# Altium schematic sheet Sheet2.SchDoc
size A2; Organization: Protel International P/L; Address1: L3, 12a Rodborough Rd; Address2: Frenchs Forest; Address3: NSW; Address4: Australia 2086
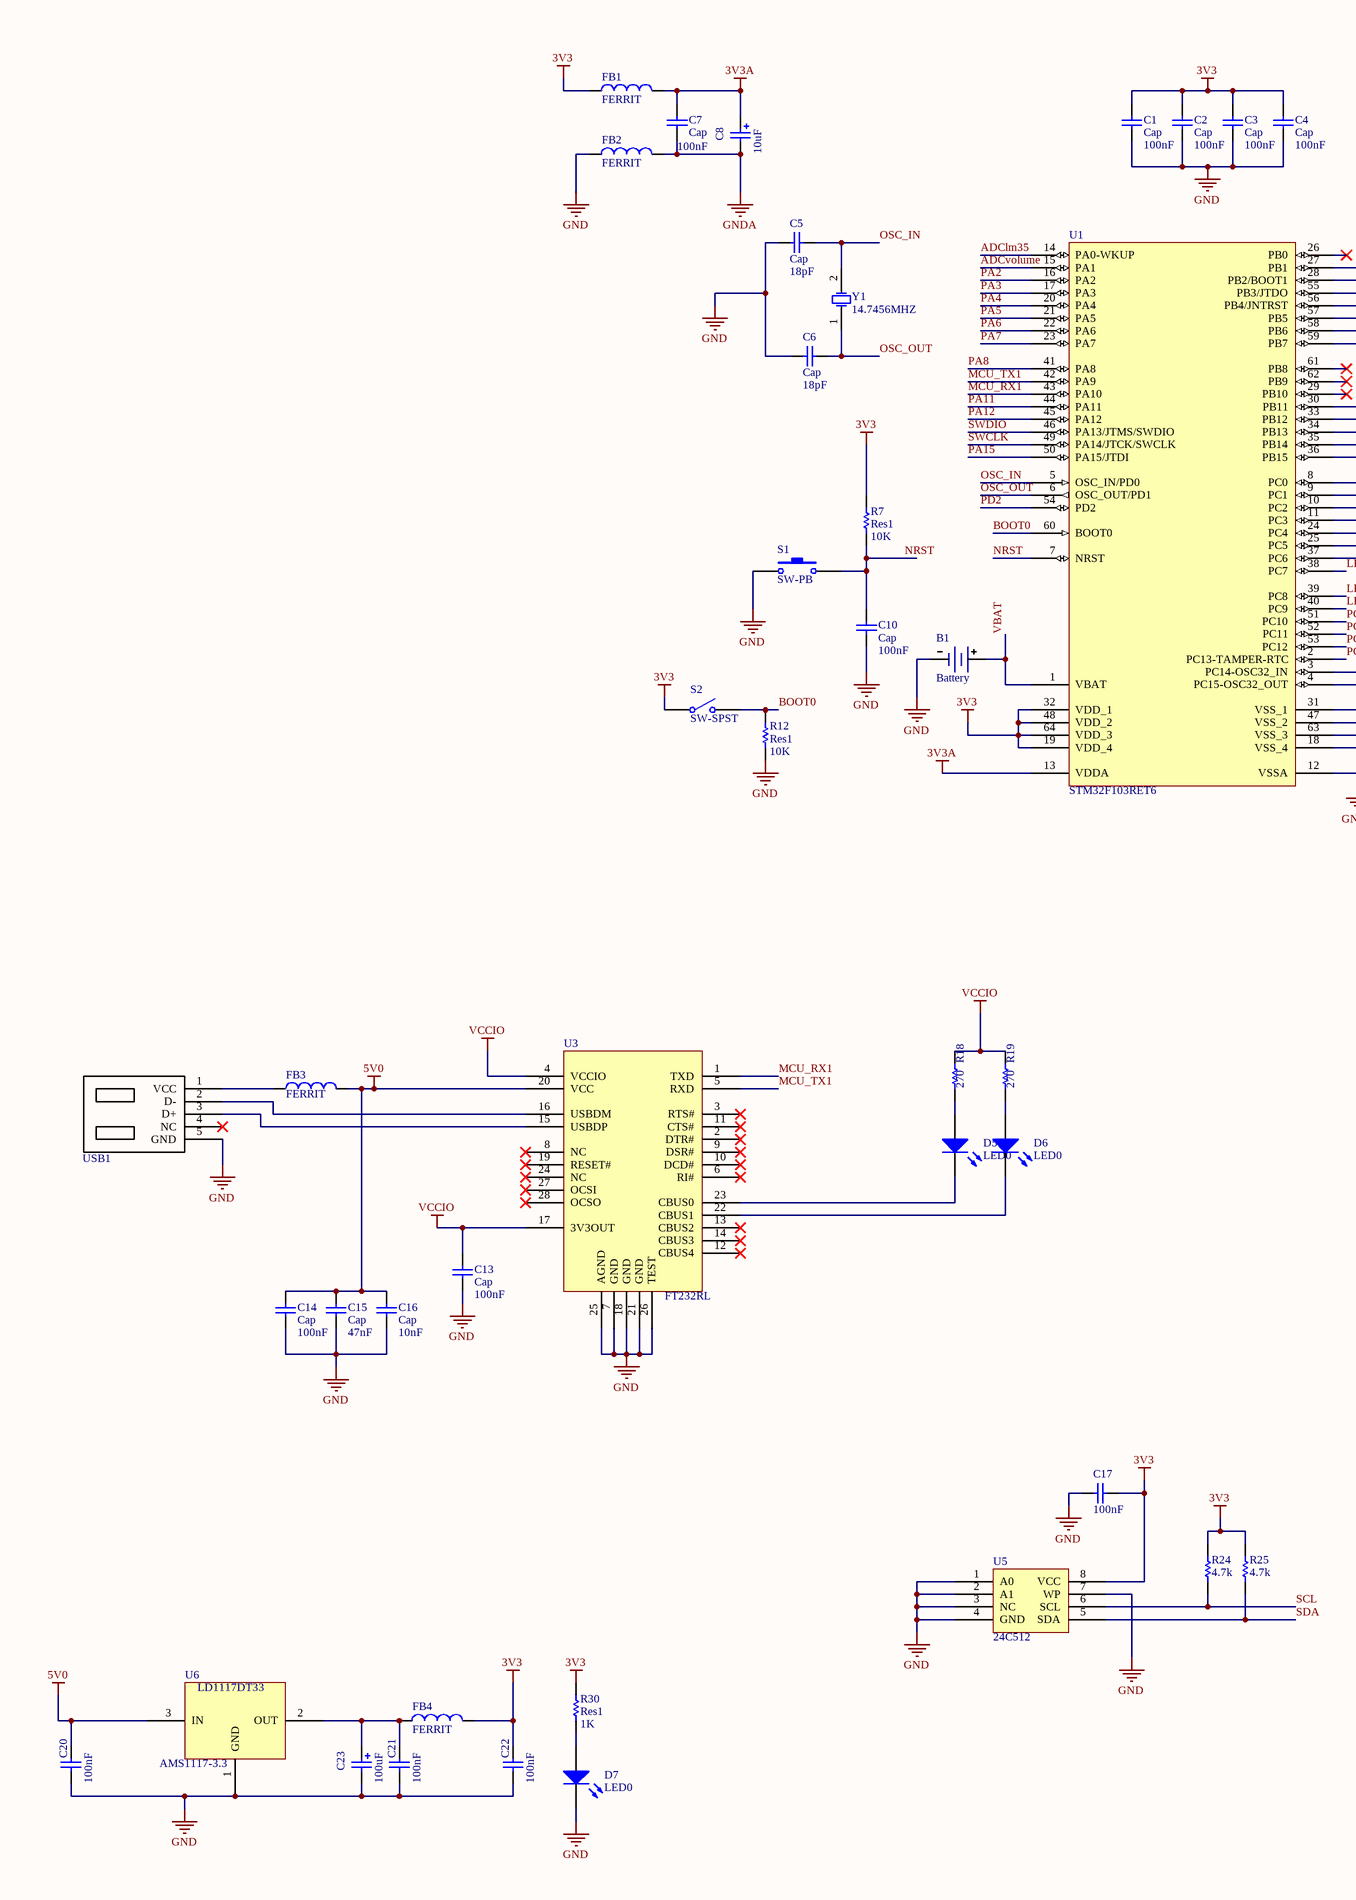
[diagram p0: Sheet2.SchDoc, left]
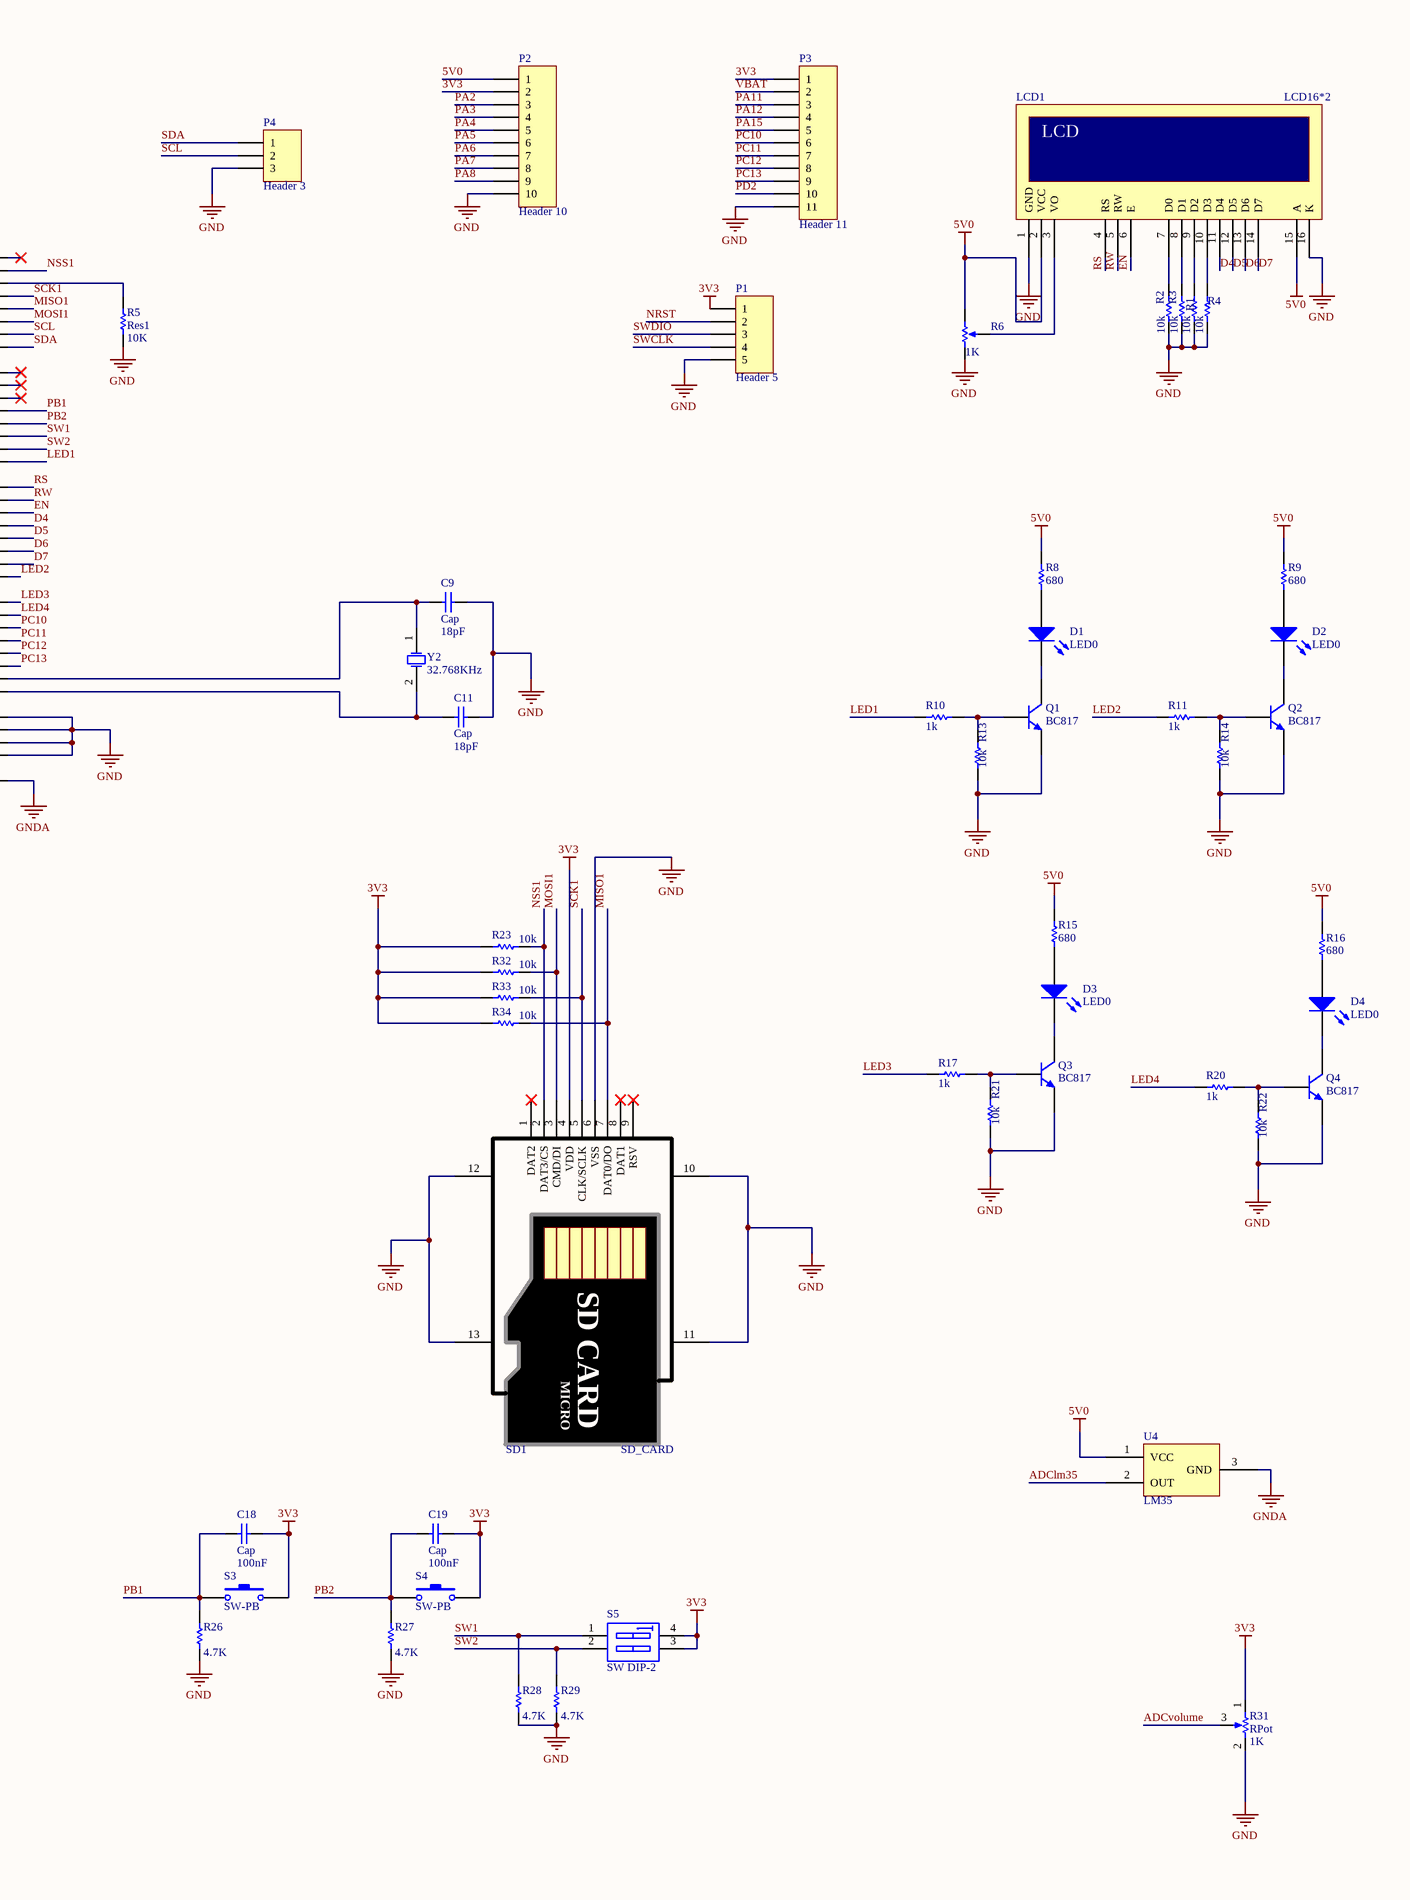
[diagram p1: Sheet2.SchDoc, right]

## Parts
B1  Battery  [Battery socket SMD]
C1  Cap  value 100nF  [SMD_805]
C2  Cap  value 100nF  [SMD_805]
C3  Cap  value 100nF  [SMD_805]
C4  Cap  value 100nF  [SMD_805]
C5  Cap  value 18pF  [SMD_805]
C6  Cap  value 18pF  [SMD_805]
C7  Cap  value 100nF  [SMD_805]
C8  value 10uF  [C_B]  (hidden comment: Cap Pol2)
C9  Cap  value 18pF  [SMD_805]
C10  Cap  value 100nF  [SMD_805]
C11  Cap  value 18pF  [SMD_805]
C13  Cap  value 100nF  [SMD_805]
C14  Cap  value 100nF  [SMD_805]
C15  Cap  value 47nF  [SMD_805]
C16  Cap  value 10nF  [SMD_805]
C17  value 100nF  [SMD_805]  (hidden comment: Cap)
C18  Cap  value 100nF  [SMD_805]
C19  Cap  value 100nF  [SMD_805]
C20  value 100nF  [SMD_805]  (hidden comment: Cap)
C21  value 100nF  [SMD_805]  (hidden comment: Cap)
C22  value 100nF  [SMD_805]  (hidden comment: Cap)
C23  value 100uF  [C_B]  (hidden comment: Cap Pol2)
D1  LED0  [SMD_805]
D2  LED0  [SMD_805]
D3  LED0  [SMD_805]
D4  LED0  [SMD_805]
D5  LED0  [SMD_805]
D6  LED0  [SMD_805]
D7  LED0  [SMD_805]
FB1  FERRIT  [SMD_805]
FB2  FERRIT  [SMD_805]
FB3  FERRIT  [SMD_805]
FB4  FERRIT  [SMD_805]
LCD1  LCD16*2  [LCD2X16]
P1  Header 5  [HDR1X5]
P2  Header 10  [HDR1X10]
P3  Header 11  [HDR1X11]
P4  Header 3  [HDR1X3]
Q1  BC817  [SOT23]
Q2  BC817  [SOT23]
Q3  BC817  [SOT23]
Q4  BC817  [SOT23]
R1  value 10k  [SMD_805]  (hidden comment: Res1)
R2  value 10k  [SMD_805]  (hidden comment: Res1)
R3  value 10k  [SMD_805]  (hidden comment: Res1)
R4  value 10k  [SMD_805]  (hidden comment: Res1)
R5  Res1  value 10K  [SMD_805]
R6  value 1K  [pot]  (hidden comment: RPot)
R7  Res1  value 10K  [SMD_805]
R8  value 680  [SMD_805]  (hidden comment: Res1)
R9  value 680  [SMD_805]  (hidden comment: Res1)
R10  value 1k  [SMD_805]  (hidden comment: Res1)
R11  value 1k  [SMD_805]  (hidden comment: Res1)
R12  Res1  value 10K  [SMD_805]
R13  value 10k  [SMD_805]  (hidden comment: Res1)
R14  value 10k  [SMD_805]  (hidden comment: Res1)
R15  value 680  [SMD_805]  (hidden comment: Res1)
R16  value 680  [SMD_805]  (hidden comment: Res1)
R17  value 1k  [SMD_805]  (hidden comment: Res1)
R18  value 270  [SMD_805]  (hidden comment: Res1)
R19  value 270  [SMD_805]  (hidden comment: Res1)
R20  value 1k  [SMD_805]  (hidden comment: Res1)
R21  value 10k  [SMD_805]  (hidden comment: Res1)
R22  value 10k  [SMD_805]  (hidden comment: Res1)
R23  value 10k  [SMD_805]  (hidden comment: Res1)
R24  value 4.7k  [SMD_805]  (hidden comment: Res1)
R25  value 4.7k  [SMD_805]  (hidden comment: Res1)
R26  value 4.7K  [SMD_805]  (hidden comment: Res1)
R27  value 4.7K  [SMD_805]  (hidden comment: Res1)
R28  value 4.7K  [SMD_805]  (hidden comment: Res1)
R29  value 4.7K  [SMD_805]  (hidden comment: Res1)
R30  Res1  value 1K  [SMD_805]
R31  RPot  value 1K  [pot]
R32  value 10k  [SMD_805]  (hidden comment: Res1)
R33  value 10k  [SMD_805]  (hidden comment: Res1)
R34  value 10k  [SMD_805]  (hidden comment: Res1)
S1  SW-PB  [smd_button]
S2  SW-SPST  [KEY1]
S3  SW-PB  [smd_button]
S4  SW-PB  [smd_button]
S5  SW DIP-2  [DIP-4]
SD1  SD_CARD  [Micro SD Card]
U1  STM32F103RET6  [LQFP64]
U3  FT232RL  [SOP28]
U4  LM35  [LM35-TO92]
U5  24C512  [SOP8]
U6  AMS1117-3.3  [SOT223]
USB1  MICRO_USB  [MINI_USB]  (value not drawn)
Y1  14.7456MHZ  [xtal_smd]
Y2  32.768KHz  [XTAL_RTC]

## Nets
3V3: C1.2 C2.2 C3.2 C4.2 C17.2 C18.2 C19.2 C22.2 FB1.1 FB4.2 P1.1 P2.2 P3.1 R7.2 R23.2 R24.2 R25.2 R30.2 R31.1(TOP) R32.2 R33.2 R34.2 S2.1(COMMON) S3.2 S4.2 S5.3(B2) S5.4(B1) SD1.4(VDD) U1.19(VDD_4) U1.32(VDD_1) U1.48(VDD_2) U1.64(VDD_3) U5.8(VCC)
3V3A: C7.2 C8.1 FB1.2 U1.13(VDDA)
5V0: C14.2 C15.2 C16.2 C20.2 FB3.2 LCD1.2(VCC) LCD1.15(A) P2.1 R6.2(BOT) R8.2 R9.2 R15.2 R16.2 U3.20(VCC) U4.1(VCC) U6.3(IN)
GND: B1.2(-) C1.1 C2.1 C3.1 C4.1 C5.1 C6.1 C9.1 C10.1 C11.1 C13.1 C14.1 C15.1 C16.1 C17.1 C20.1 C21.1 C22.1 C23.2 D7.2(K) FB2.1 LCD1.1(GND) LCD1.16(K) P1.5 P2.10 P3.11 P4.3 Q1.2(E) Q2.2(E) Q3.2(E) Q4.2(E) R1.1 R2.1 R3.1 R4.1 R5.1 R6.1(TOP) R12.1 R13.1 R14.1 R21.1 R22.1 R26.1 R27.1 R28.1 R29.1 R31.2(BOT) S1.1 SD1.6(VSS) SD1.10(BODY) SD1.11(BODY) SD1.12(BODY) SD1.13(BODY) U1.18(VSS_4) U1.31(VSS_1) U1.47(VSS_2) U1.63(VSS_3) U3.7(GND) U3.18(GND) U3.21(GND) U3.25(AGND) U3.26(TEST) U5.1(A0) U5.2(A1) U5.3(NC) U5.4(GND) U5.7(WP) U6.1(GND) USB1.5(GND)
GNDA: C7.1 C8.2 FB2.2 U1.12(VSSA) U4.3(GND)
VCCIO: C13.2 R18.2 R19.2 U3.4(VCCIO) U3.17(3V3OUT)
ADClm35: U1.14(PA0-WKUP) U4.2(OUT)
ADCvolume: R31.3(TAP) U1.15(PA1)
BOOT0: R12.2 S2.2(NO) U1.60(BOOT0)
D4: LCD1.11(D4) U1.11(PC3)
D5: LCD1.12(D5) U1.24(PC4)
D6: LCD1.13(D6) U1.25(PC5)
D7: LCD1.14(D7) U1.37(PC6)
EN: LCD1.6(E) U1.10(PC2)
LED1: R10.1 U1.36(PB15)
LED2: R11.1 U1.38(PC7)
LED3: R17.1 U1.39(PC8)
LED4: R20.1 U1.40(PC9)
MCU_RX1: U1.43(PA10) U3.1(TXD)
MCU_TX1: U1.42(PA9) U3.5(RXD)
MISO1: R34.1 SD1.7(DAT0/DO) U1.56(PB4/JNTRST)
MOSI1: R32.1 SD1.3(CMD/DI) U1.57(PB5)
NRST: C10.2 P1.2 R7.1 S1.2 U1.7(NRST)
NSS1: R23.1 SD1.2(DAT3/CS) U1.27(PB1)
OSC_IN: C5.2 U1.5(OSC_IN/PD0) Y1.2(OSC2)
OSC_OUT: C6.2 U1.6(OSC_OUT/PD1) Y1.1(OSC1)
PA2: P2.3 U1.16(PA2)
PA3: P2.4 U1.17(PA3)
PA4: P2.5 U1.20(PA4)
PA5: P2.6 U1.21(PA5)
PA6: P2.7 U1.22(PA6)
PA7: P2.8 U1.23(PA7)
PA8: P2.9 U1.41(PA8)
PA11: P3.3 U1.44(PA11)
PA12: P3.4 U1.45(PA12)
PA15: P3.5 U1.50(PA15/JTDI)
PB1: C18.1 R26.2 S3.1 U1.30(PB11)
PB2: C19.1 R27.2 S4.1 U1.33(PB12)
PC10: P3.6 U1.51(PC10)
PC11: P3.7 U1.52(PC11)
PC12: P3.8 U1.53(PC12)
PC13: P3.9 U1.2(PC13-TAMPER-RTC)
PD2: P3.10 U1.54(PD2)
RS: LCD1.4(RS) U1.8(PC0)
RW: LCD1.5(RW) U1.9(PC1)
SCK1: R33.1 SD1.5(CLK/SCLK) U1.55(PB3/JTDO)
SCL: P4.2 R24.1 U1.58(PB6) U5.6(SCL)
SDA: P4.1 R25.1 U1.59(PB7) U5.5(SDA)
SW1: R28.2 S5.1(A1) U1.34(PB13)
SW2: R29.2 S5.2(A2) U1.35(PB14)
SWCLK: P1.4 U1.49(PA14/JTCK/SWCLK)
SWDIO: P1.3 U1.46(PA13/JTMS/SWDIO)
VBAT: B1.1(+) P3.2 U1.1(VBAT)
NetC9_2: C9.2 U1.3(PC14-OSC32_IN) Y2.1(OSC1)
NetC11_2: C11.2 U1.4(PC15-OSC32_OUT) Y2.2(OSC2)
NetC21_2: C21.2 C23.1 FB4.1 U6.2(OUT)
NetD1_1: D1.1(A) R8.1
NetD1_2: D1.2(K) Q1.3(C)
NetD2_1: D2.1(A) R9.1
NetD2_2: D2.2(K) Q2.3(C)
NetD3_1: D3.1(A) R15.1
NetD3_2: D3.2(K) Q3.3(C)
NetD4_1: D4.1(A) R16.1
NetD4_2: D4.2(K) Q4.3(C)
NetD5_1: D5.1(A) R18.1
NetD5_2: D5.2(K) U3.23(CBUS0)
NetD6_1: D6.1(A) R19.1
NetD6_2: D6.2(K) U3.22(CBUS1)
NetD7_1: D7.1(A) R30.1
NetFB3_1: FB3.1 USB1.1(VCC)
NetLCD1_3: LCD1.3(VO) R6.3(TAP)
NetLCD1_7: LCD1.7(D0) R2.2
NetLCD1_8: LCD1.8(D1) R3.2
NetLCD1_9: LCD1.9(D2) R4.2
NetLCD1_10: LCD1.10(D3) R1.2
NetQ1_1: Q1.1(B) R10.2 R13.2
NetQ2_1: Q2.1(B) R11.2 R14.2
NetQ3_1: Q3.1(B) R17.2 R21.2
NetQ4_1: Q4.1(B) R20.2 R22.2
NetR5_2: R5.2 U1.28(PB2/BOOT1)
NetU3_15: U3.15(USBDP) USB1.3(D+)
NetU3_16: U3.16(USBDM) USB1.2(D-)

Not connected (* = marked no-connect by the designer): SD1 1(DAT2)* 8(DAT1)* 9(RSV)*; U1 26(PB0)* 29(PB10)* 61(PB8)* 62(PB9)*; U3 2(DTR#)* 3(RTS#)* 6(RI#)* 8(NC)* 9(DSR#)* 10(DCD#)* 11(CTS#)* 12(CBUS4)* 13(CBUS2)* 14(CBUS3)* 19(RESET#)* 24(NC)* 27(OCSI)* 28(OCSO)*; USB1 4(NC)*

## Notes on the sheet
- Title
- Size:
- Date:
- File:
- A2
- Number:
- Time:
- Revision:
- Sheet
- of
- (in symbol LCD16*2) LCD
- (in symbol MICRO_SD_CARD_HOLDER) SD CARD; MICRO

## Library data of the parts
B1 = Battry Backup
C1-C7 C9-C11 C13-C22 = Cap: Capacitor; Published: 8-Jun-2000; LatestRevisionDate: 17-Jul-2002; LatestRevisionNote: Re-released for DXP Platform.; PackageReference: RAD-0.3; Publisher: Altium Limited
C8 C23 = Cap Pol2: Polarized Capacitor (Axial); Published: 8-Jun-2000; LatestRevisionDate: 17-Jul-2002; LatestRevisionNote: Re-released for DXP Platform.; PackageReference: POLAR0.8; Publisher: Altium Limited
D1-D7 = LED0: Typical INFRARED GaAs LED; Published: 8-Jun-2000; LatestRevisionDate: 08-Jul-2005; LatestRevisionNote: Mech Layer 1 removed.; PackageReference: LED-0; Publisher: Altium Limited
FB1-FB4 = Inductor: Code_IEC: 1005; Published: 8-Jun-2000; LatestRevisionDate: 29-May-2009; LatestRevisionNote: IPC-7351 Footprint Added.; PackageReference: 0402-A; Publisher: Altium Limited; PackageDescription: Chip Inductor; Code_JEITA: 0402
P1 = Header 5: Header, 5-Pin; LatestRevisionDate: 17-Jul-2002; LatestRevisionNote: Re-released for DXP Platform.; Publisher: Altium Limited
P2 = Header 10: Header, 10-Pin; LatestRevisionDate: 17-Jul-2002; LatestRevisionNote: Re-released for DXP Platform.; Publisher: Altium Limited
P3 = Header 11: Header, 11-Pin; LatestRevisionDate: 17-Jul-2002; LatestRevisionNote: Re-released for DXP Platform.; Publisher: Altium Limited
P4 = Header 3: Header, 3-Pin; LatestRevisionDate: 17-Jul-2002; LatestRevisionNote: Re-released for DXP Platform.; Publisher: Altium Limited
Q1-Q4 = 2N3904: NPN General Purpose Amplifier; Published: 8-Jun-2000; LatestRevisionDate: 15-Jan-2003; LatestRevisionNote: PCB Footprint 'BCY-W3/D4.7' replaced; DatasheetVersion: 1997; PackageVersion: Sep-1998; PackageReference: TO-92A; Publisher: Altium Limited; Code_JEDEC: TO-92A; ComponentLink1Description: Manufacturer Link; ComponentLink1URL: http://www.fairchildsemi.com/; ComponentLink2Description: Datasheet; ComponentLink2URL: http://www.fairchildsemi.com/ds/2N%2F2N3904.pdf
R1-R5 R7-R30 R32-R34 = Res1: Resistor; Published: 8-Jun-2000; LatestRevisionDate: 17-Jul-2002; LatestRevisionNote: Re-released for DXP Platform.; PackageReference: AXIAL-0.3; Publisher: Altium Limited
R6 R31 = RPot: Potentiometer; Sim Note: Enter the Resistance value and the set point into parameter fields.; Set Position: 0.5; Published: 8-Jun-2000; LatestRevisionDate: 17-Jul-2002; LatestRevisionNote: Re-released for DXP Platform.; PackageReference: VR5; Publisher: Altium Limited
  R31: PackageDescription: Variable Resistor, Thru-Hole; 3 Leads
S1 S3 S4 = SW-PB: Switch; Published: 24-Mar-1999; LatestRevisionDate: 17-Jul-2002; LatestRevisionNote: Re-released for DXP Platform.; PackageReference: SPST-2; Publisher: Altium Limited
S2 = SW-SPST: Single-Pole, Single-Throw Switch; Published: 24-Mar-1999; LatestRevisionDate: 17-Jul-2002; LatestRevisionNote: Re-released for DXP Platform.; PackageReference: SPST-2; Publisher: Altium Limited
S5 = SW DIP-2: DIP Switch, 2 Position, SPST; Published: 24-Mar-1999; LatestRevisionDate: 17-Jul-2002; LatestRevisionNote: Re-released for DXP Platform.; PackageReference: DIP-4; Publisher: Altium Limited
SD1 = MICRO_SD_CARD_HOLDER
U1 = STM32F103R8T6: STM32 ARM-based 32-bit MCU with 64 Kbytes Flash, 64-pin LQFP, Industrial Temperature; Published: 30-May-2008; DatasheetVersion: rev6, Mar-2008; PackageVersion: Mar-2008; PackageReference: LQFP64; Publisher: Altium Limited; PackageDescription: 64-Pin Low-Profile Quad Flat Pack, 10 x 10 mm Body, 0.5 mm Pitch (LQFP64); ComponentLink1Description: Manufacturer Link; ComponentLink1URL: www.st.com/stm32; ComponentLink2Description: Datasheet; ComponentLink2URL: http://www.st.com/stonline/products/literature/ds/13587.pdf
U4 = LM35: LM35 Temperature Sensor; Designer: Seyed Mohsen Ghasemain; E-mail: picpars@gmail.com; ComponentLinkURL: www.picpars.com
U5 = 24Cxx
U6 = LD1117DT33
Y1 Y2 = XTAL: Crystal Oscillator; Published: 8-Jun-2000; LatestRevisionDate: 17-Jul-2002; LatestRevisionNote: Re-released for DXP Platform.; PackageReference: R38; Publisher: Altium Limited